# Altium project Timingcard_PROJECT.PrjPcb
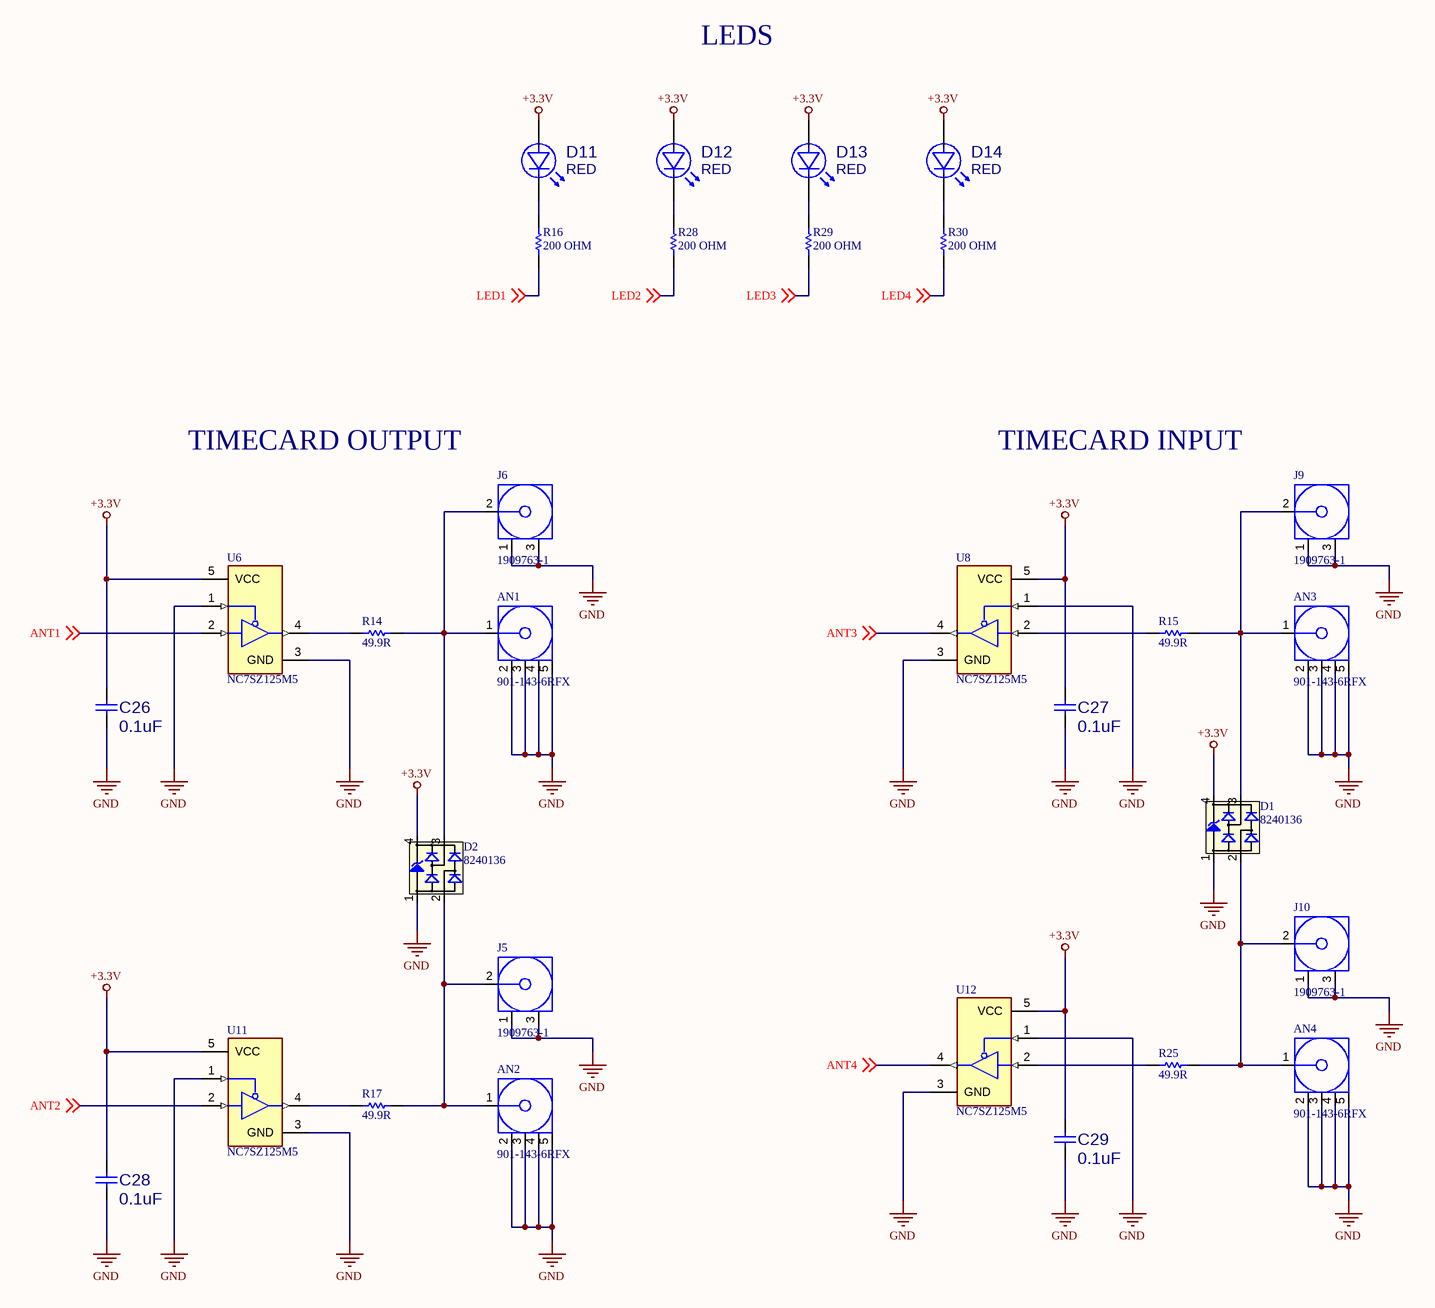
[diagram p0: USER_IO.SchDoc]
4 sheets, 80 parts. Net scope: global (net labels, ports and power ports of the same name join across sheets).
Board file: TimeCard-DC-V2.PcbDoc
Sheets:
  USER_IO.SchDoc
  POWER.SchDoc
  MAC.SchDoc
  FPGA.SchDoc

## Sheet USER_IO.SchDoc
size Tabloid; SheetNumber: 1; SheetTotal: 7

### Parts
AN1  901-143-6RFX  [AMPH-901-143-6RFX_V]
AN2  901-143-6RFX  [AMPH-901-143-6RFX_V]
AN3  901-143-6RFX  [AMPH-901-143-6RFX_V]
AN4  901-143-6RFX  [AMPH-901-143-6RFX_V]
C26  0.1uF  [CAPC1608X87X45ML20T05]
C27  0.1uF  [CAPC1608X87X45ML20T05]
C28  0.1uF  [CAPC1608X87X45ML20T05]
C29  0.1uF  [CAPC1608X87X45ML20T05]
D1  8240136  [SOT143-4L]
D2  8240136  [SOT143-4L]
D11  RED  [DIOM1608X06N]
D12  RED  [DIOM1608X06N]
D13  RED  [DIOM1608X06N]
D14  RED  [DIOM1608X06N]
J5  1909763-1  [TECO-1909763-1_V]
J6  1909763-1  [TECO-1909763-1_V]
J9  1909763-1  [TECO-1909763-1_V]
J10  1909763-1  [TECO-1909763-1_V]
R14  49.9R  [RESC1608X55X25NL10T15]
R15  49.9R  [RESC1608X55X25NL10T15]
R16  200 OHM  [RESC1608X55X30NL15T15]
R17  49.9R  [RESC1608X55X25NL10T15]
R25  49.9R  [RESC1608X55X25NL10T15]
R28  200 OHM  [RESC1608X55X30NL15T15]
R29  200 OHM  [RESC1608X55X30NL15T15]
R30  200 OHM  [RESC1608X55X30NL15T15]
U6  NC7SZ125M5  [FP-318BQ-MFG]
U8  NC7SZ125M5  [FP-318BQ-MFG]
U11  NC7SZ125M5  [FP-318BQ-MFG]
U12  NC7SZ125M5  [FP-318BQ-MFG]

### Nets
+3.3V: C26.1 C27.1 C28.1 C29.1 D1.4(VDD) D2.4(VDD) D11.2(A) D12.2(A) D13.2(A) D14.2(A) U6.5(VCC) U8.5(VCC) U11.5(VCC) U12.5(VCC)
GND: AN1.2 AN1.3 AN1.4 AN1.5 AN2.2 AN2.3 AN2.4 AN2.5 AN3.2 AN3.3 AN3.4 AN3.5 AN4.2 AN4.3 AN4.4 AN4.5 C26.2 C27.2 C28.2 C29.2 D1.1(GND) D2.1(GND) J5.1 J5.3 J6.1 J6.3 J9.1 J9.3 J10.1 J10.3 U6.1(~{OE}) U6.3(GND) U8.1(~{OE}) U8.3(GND) U11.1(~{OE}) U11.3(GND) U12.1(~{OE}) U12.3(GND)
ANT1: U6.2(A) ; off-sheet ANT1
ANT2: U11.2(A) ; off-sheet ANT2
ANT3: U8.4(Y) ; off-sheet ANT3
ANT4: U12.4(Y) ; off-sheet ANT4
LED1: R16.1 ; off-sheet LED1
LED2: R28.1 ; off-sheet LED2
LED3: R29.1 ; off-sheet LED3
LED4: R30.1 ; off-sheet LED4
NetAN1_1: AN1.1 D2.3(I/O2) J6.2 R14.2
NetAN2_1: AN2.1 D2.2(I/O1) J5.2 R17.2
NetAN3_1: AN3.1 D1.3(I/O2) J9.2 R15.2
NetAN4_1: AN4.1 D1.2(I/O1) J10.2 R25.2
NetD11_1: D11.1(K) R16.2
NetD12_1: D12.1(K) R28.2
NetD13_1: D13.1(K) R29.2
NetD14_1: D14.1(K) R30.2
NetR14_1: R14.1 U6.4(Y)
NetR15_1: R15.1 U8.2(A)
NetR17_1: R17.1 U11.4(Y)
NetR25_1: R25.1 U12.2(A)

### Notes on the sheet
- LEDS
- TIMECARD OUTPUT
- TIMECARD INPUT
- SHEET
- timingcard.com <http://timingcard.com>
- OF

### Library data of the parts
AN1-AN4 = CMP-2000-05705-1: Coaxial connector, 50 Ohm, -65 to 165 degC, 5-Pin THD, RoHS, Bulk; Manufacturer: Amphenol; Catalog Drawings: 901-143-6RFXMountingHole; 3D Model: 901-143-6RFX.igs; Body Material: Brass; Connector Type: Jack,FemaleSocket; Shield Termination: Solder; Other Names: 901-143-6-RFX9011436RFXARFX1232; Online Catalog: SMA,RFX; Frequency - Max: 18GHz; Body Finish: Gold; Dielectric Material: Polytetrafluoroethylene(PTFE); Center Contact Material: BerylliumCopper; Impedance: 50Ohm; Connector Style: SMA; Mounting Technology: ThroughHole; Mounting Type: ThroughHole,RightAngle; Cable Group: -; Series: -; Package Description: 5-Pin Through Hole Device, Body 7 x 7 mm, Pitch 2.54 mm; Package Reference: 901-143-6RFX; Voltage Rating: -; Standard Package: 1; Fastening Type: Threaded; Housing Color: Gold; Datasheet URL: http://www.amphenolrf.com/downloads/dl/file/id/2712/product/3102/901_143_6rfx_customer_drawing.pdf; Family: CoaxialConnectors(RF); Contact Termination: Solder; Manufacturer URL: http://www.amphenol.com/; Operating Temperature: -65°C~165°C; Category: Connectors,Interconnects; Packaging: Bulk; Features: -; Center Contact Plating: Gold; Datasheet Version: Rev. C, 06/2010; Ingress Protection: -
C26-C29 = CMP-2006-00003-1: C0603X104K5RACAUTO; Manufacturer: Kemet; Part Number: C0603X104K5RACAUTO
D1 D2 = CMP-1486-00002-1: TVS Diode WE-TVS-HS, VRWM=3.3V; Manufacturer: Wuerth Elektronik; Reverse Stand Off Voltage: 3.3V; PartNumber: 8240136; ComponentLink1Description: Manufacturer URL; PackageReference: SOT143-4L; ComponentLink1URL: http://www.we-online.com; ComponentLink2Description: Datasheet; ComponentLink2URL: http://katalog.we-online.de/kataloge/eisos/media/pdf/8240136.pdf
D11-D14 = SMTLED_RED_0603_SML: LED, RED, SML-LX0603, 635NM, 2V, 20MA, 0603; MFG PART NUM: SML-LX0603IW-TR; VALENTIUM PART NUM: <VALENTIUM>; MFG NAME: LUMEX; MAXTEMP: 85C; MINTEMP: -25C; MODIFY DATE: 9/4/2013; CATEGORY: LED; OTHER: SML-LX0603; P1: 635NM; P2: 2V; P3: 20MA; SIZE: 0603; SHEETPART: *; DESC: LED, RED, SML-LX0603, 635NM, 2V, 20MA, 0603; Supplier 1: Digi-Key; Supplier Part Number 1: 67-1548-1-ND; VALUE: RED
J5 J6 J9 J10 = CMP-2000-07505-1: Ultra Miniature Coaxial Connector Jack, 60 V, 50 Ohm, -40 to 90 degC, RoHS, Tape and Reel; Manufacturer: TE Connectivity; Gender: Female; PCB Mounting Orientation: Vertical; Body Material: LiquidCrystalPolymer; Case\/Package: SMD/SMT; Impedance: 50Ohm; Max Frequency: 6GHz; Body Plating: Gold; Dielectric Material: Polymer; Orientation: Straight; Mount: SurfaceMount; Length: 3mm; Packaging: TapeandReel; Connector Type: Jack; Lead Free: LeadFree; Package Quantity: 1; Termination: SMD/SMT; Contact Material: CopperAlloy; Fastening Type: Pull; RoHSCompliant: true; Max Operating Temperature: 90degC; Datasheet URL: http://www.te.com/commerce/DocumentDelivery/DDEController?Action=srchrtrv&DocNm=1909763&DocType=Customer+Drawing&DocLang=English; Contact Plating: Gold; Mounting Technology: SurfaceMount; Package Reference: TECO-1909763-1; Insulation Material: Thermoplastic; Min Operating Temperature: -40degC; Manufacturer URL: http://www.te.com/; ELV: Compliant; Datasheet Version: Rev. B2, 11/2015; Radiation Hardening: No; Package Description: 3-Pin Surface Mount Device, Body 2.6 x 2.6 mm; Housing Colour: Beige
R14 R15 R17 R25 = CMP-1659-00036-1: General Purpose Chip Resistor, 49.9 Ohm, +/- 1%, -55 to 155 degC, 0603 (1608 Metric), RoHS, Tape and Reel; Max Supply Voltage: 3.63 V; Case\Package: LQFP; Interface: SPI; Min Supply Voltage: 2.97 V; PackageReference: 0603; Packaging: Tray; ComponentLink2Description: Datasheet; ComponentLink1Description: Manufacturer URL; ComponentLink2URL: https://datasheet.ciiva.com/11808/0900766b80f96399-11808223.pdf; RoHSCompliant: true; Max Operating Temperature: 85 degC; ComponentLink1URL: http://www.yageo.com/; PackageDescription: 2-Pin Surface Mount Device, Body 1.6 x 0.8 mm; DatasheetVersion: Rev. 4, 04/2009; Min Operating Temperature: -40 degC; Package Quantity: 250; Pins: 48
R16 R28-R30 = CMP-2000-00316-1: ERJ-3EKF2000V; Manufacturer: Panasonic; Part Number: ERJ-3EKF2000V
U6 U8 U11 U12 = CMP-07111-000001-1: IC BUF NON-INVERT 5.5V SOT23-5; Manufacturer: ON Semiconductor; Number Of Circuits: 1; Max Junction Temp: +150°C; Standoff Height: 0.01mm; Logic Function Desc: Non-Inverting; Nominal Supply Current: 2uA; Min Supply Voltage: 1.65V; Propagation Delay: 2.6ns; Temperature Range High: +85°C; Number Of Outputs: 1; RoHS: TRUE; Automotive: No; Category: IC; Ambient Temperature Range High: +85°C; Manufacturer Part Number: NC7SZ125M5; Device Class L3: Buffers; Temperature Range Low: -40°C; Mouser Description: Buffers & Line Drivers Buffer w/ 3-STAT O; Ambient Temperature Range Low: -40°C; Lead Free: Yes; Ipc Land Pattern Name: SOT95P275X100-5; Footprint Url: https://www.onsemi.com/pub/Collateral/527AH.PDF; Device Class L2: Logic ICs; Max Supply Voltage: 5.5V; Quiescent Current: 2uA; Number Of Inputs: 1; Height: 1.1mm; Temperature: -40°C to +85°C; Device Class L1: Integrated Circuits (ICs); ComponentLink2URL: https://www.onsemi.com/pub/Collateral/NC7SZ125-D.PDF; Digikey Description: IC BUF NON-INVERT 5.5V SOT23-5; Package: 318BQ; Octopart: https://octopart.com/nc7sz125m5-on+semiconductor-84330746; ComponentLink2Description: Datasheet

## Sheet POWER.SchDoc: Grandmaster Power Supplies
size Tabloid; Author: N Smith; Revision: A; SheetNumber: 2; SheetTotal: 7; Customer: 01910
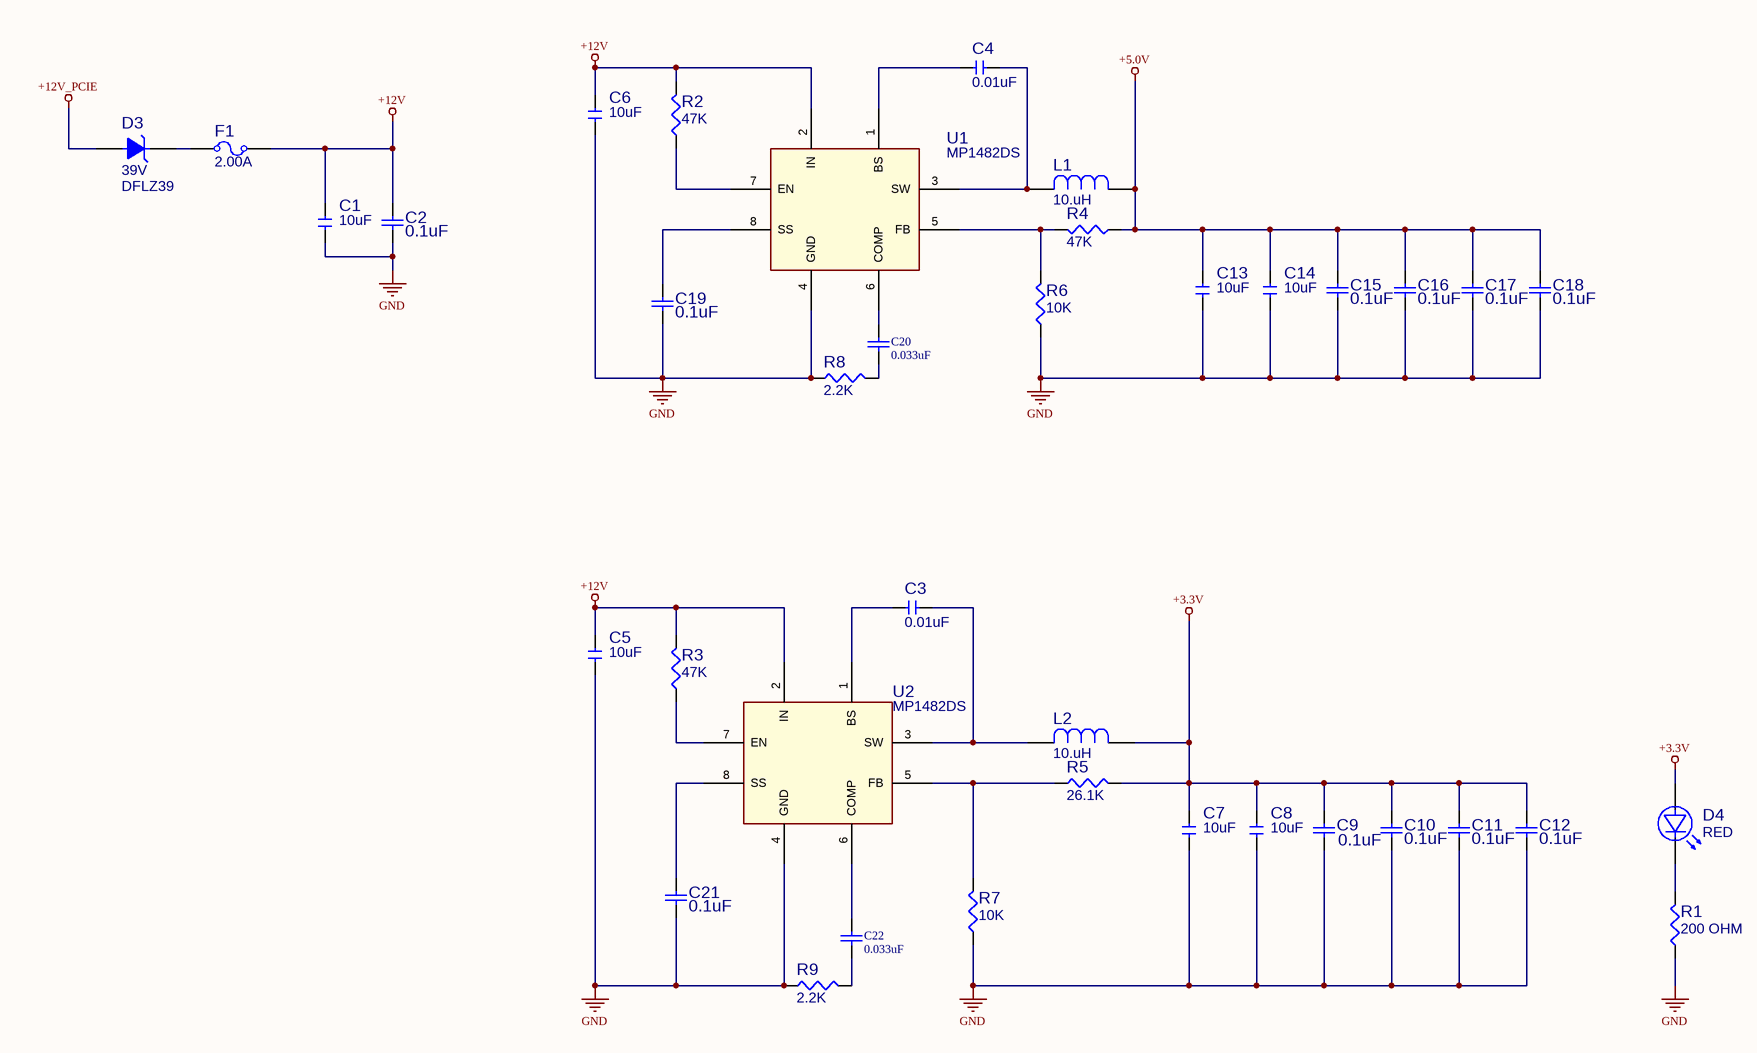
[diagram p1: POWER.SchDoc]

### Parts
C1  value 10uF  [CAPC2012X14N]  (hidden comment: CAP_0805_10UF_25V)
C2  0.1uF  [CAPC1608X87X45ML20T05]
C3  value 0.01uF  [CAPC1608X10N]  (hidden comment: CAP_0603_0.01UF_50V)
C4  value 0.01uF  [CAPC1608X10N]  (hidden comment: CAP_0603_0.01UF_50V)
C5  value 10uF  [CAPC2012X14N]  (hidden comment: CAP_0805_10UF_25V)
C6  value 10uF  [CAPC2012X14N]  (hidden comment: CAP_0805_10UF_25V)
C7  value 10uF  [CAPC2012X14N]  (hidden comment: CAP_0805_10UF_25V)
C8  value 10uF  [CAPC2012X14N]  (hidden comment: CAP_0805_10UF_25V)
C9  0.1uF  [CAPC1608X87X45ML20T05]
C10  0.1uF  [CAPC1608X87X45ML20T05]
C11  0.1uF  [CAPC1608X87X45ML20T05]
C12  0.1uF  [CAPC1608X87X45ML20T05]
C13  value 10uF  [CAPC2012X14N]  (hidden comment: CAP_0805_10UF_25V)
C14  value 10uF  [CAPC2012X14N]  (hidden comment: CAP_0805_10UF_25V)
C15  0.1uF  [CAPC1608X87X45ML20T05]
C16  0.1uF  [CAPC1608X87X45ML20T05]
C17  0.1uF  [CAPC1608X87X45ML20T05]
C18  0.1uF  [CAPC1608X87X45ML20T05]
C19  0.1uF  [CAPC1608X87X45ML20T05]
C20  0.033uF  [CAPC1608X90X35NL10T15]
C21  0.1uF  [CAPC1608X87X45ML20T05]
C22  0.033uF  [CAPC1608X90X35NL10T15]
D3  value DFLZ39  P1: 39V  [SODFL370X135-2N]  (hidden comment: DFLZ39-TP)
D4  RED  [DIOM1608X06N]
F1  value 2.00A  [FUSM1608X60N]  (hidden comment: FUSE_0603_2.00A)
L1  value 10.uH  [IND_PM124SH]  (hidden comment: PM124SH-100M-RC)
L2  value 10.uH  [IND_PM124SH]  (hidden comment: PM124SH-100M-RC)
R1  value 200 OHM  [RESC1608X50N]  (hidden comment: ERJ-3EKF2000V)
R2  value 47K  [RESC1608X50N]  (hidden comment: ERJ-3EKF4702V)
R3  value 47K  [RESC1608X50N]  (hidden comment: ERJ-3EKF4702V)
R4  value 47K  [RESC1608X50N]  (hidden comment: ERJ-3EKF4702V)
R5  value 26.1K  [RESC1608X50N]  (hidden comment: ERJ-3EKF2612V)
R6  value 10K  [RESC1608X50N]  (hidden comment: ERJ-3EKF1002V)
R7  value 10K  [RESC1608X50N]  (hidden comment: ERJ-3EKF1002V)
R8  value 2.2K  [RESC1608X50N]  (hidden comment: ERJ-3EKF2201V)
R9  value 2.2K  [RESC1608X50N]  (hidden comment: ERJ-3EKF2201V)
U1  value MP1482DS  [SOIC127P600X175-8N]  (hidden comment: MP1482DS-LF)
U2  value MP1482DS  [SOIC127P600X175-8N]  (hidden comment: MP1482DS-LF)

### Nets
+3.3V: C7.1 C8.1 C9.2 C10.2 C11.2 C12.2 D4.2(A) L2.1 R5.2
+5.0V: C13.1 C14.1 C15.2 C16.2 C17.2 C18.2 L1.1 R4.1
+12V: C1.1 C2.2 C5.1 C6.1 F1.2 R2.2 R3.2 U1.2(IN) U2.2(IN)
+12V_PCIE: D3.2(A)
GND: C1.2 C2.1 C5.2 C6.2 C7.2 C8.2 C9.1 C10.1 C11.1 C12.1 C13.2 C14.2 C15.1 C16.1 C17.1 C18.1 C19.1 C21.1 R1.1 R6.1 R7.1 R8.1 R9.1 U1.4(GND) U2.4(GND)
NetC3_1: C3.1 U2.1(BS)
NetC3_2: C3.2 L2.2 U2.3(SW)
NetC4_1: C4.1 U1.1(BS)
NetC4_2: C4.2 L1.2 U1.3(SW)
NetC19_2: C19.2 U1.8(SS)
NetC20_1: C20.1 R8.2
NetC20_2: C20.2 U1.6(COMP)
NetC21_2: C21.2 U2.8(SS)
NetC22_1: C22.1 R9.2
NetC22_2: C22.2 U2.6(COMP)
NetD3_1: D3.1(C) F1.1
NetD4_1: D4.1(K) R1.2
NetR2_1: R2.1 U1.7(EN)
NetR3_1: R3.1 U2.7(EN)
NetR4_2: R4.2 R6.2 U1.5(FB)
NetR5_1: R5.1 R7.2 U2.5(FB)

### Notes on the sheet
- SHEET
- timingcard.com <http://timingcard.com>
- OF

### Library data of the parts
C1 C5-C8 C13 C14 = CAP_0805_10UF_25V: CAP, CER, 10.UF, 25V, 10%, X5R, 0805; MFG PART NUM: TMK212BBJ106KG-T; VALENTIUM PART NUM: <VALENTIUM>; MFG NAME: TAIYO YUDEN; MAXTEMP: 85C; MINTEMP: -55C; DESC: CAP, CER, 10.UF, 10V, 10%, X5R, 0805; MODIFY DATE: 10/23/2013; CATEGORY: CAP, CER; Date: 4/11/2006 3:37:28 PM; SHEETPART: *; P1: 10%; P2: 25V; P3: X5R; Size: 0805; Supplier 1: MOUSER; Supplier Part Number 1: 963-TMK212BBJ106KG-T
C2 C9-C12 C15-C19 C21 = CMP-2006-00003-1: C0603X104K5RACAUTO; Manufacturer: Kemet; Part Number: C0603X104K5RACAUTO
C3 C4 = CAP_0603_0.01UF_50V: CAP, CER, 0.01UF, 50V, 10%, X7R, 0603; MFG PART NUM: C0603C103K5RACTU; VALENTIUM PART NUM: <VALENTIUM>; MFG NAME: KEMET; MAXTEMP: 125C; MINTEMP: -55C; CATEGORY: CAP, CER; MODIFY DATE: 10/23/2013; Date: 7/24/2013; SHEETPART: *; P1: 10%; P2: 50V; P3: X7R; Size: 0603; Supplier 1: Digi-Key; Supplier Part Number 1: 399-1091-1-ND; DESC: CAP, CER, 0.01UF, 50V, 10%, X7R, 0603
C20 C22 = CMP-2006-02385-1: GCM188R71H333KA55D; Manufacturer: Murata; Part Number: GCM188R71H333KA55D
D3 = DFLZ39: DIO, ZENER, DFLZ39, 39V, 5%, 1W, SOD123FL; VALENTIUM PART NUM: <VALENTIUM>; MFG NAME: MICRO COMM; MAXTEMP: 150C; MINTEMP: -55C; OTHER: SERIES; MFG PART NUM: DFLZ39-TP; MODIFY DATE: 9/4/2013; CATEGORY: DIO, ZENER; P2: 5%; P3: 1W; SIZE: SOD123FL; SHEETPART: *; DESC: DIO, ZENER, DFLZ39, 39V, 5%, 1W, SOD123FL; Supplier 1: Digi-Key; Supplier Part Number 1: DFLZ39-TPMSDKR-ND
D4 = SMTLED_RED_0603_SML: as D11 on sheet USER_IO; MODIFY DATE: 9/4/2013; CATEGORY: LED; OTHER: SML-LX0603; P1: 635NM; P2: 2V; P3: 20MA; SIZE: 0603; SHEETPART: *; DESC: LED, RED, SML-LX0603, 635NM, 2V, 20MA, 0603; Supplier 1: Digi-Key; Supplier Part Number 1: 67-1548-1-ND; VALUE: RED
F1 = FUSE_0603_2.00A: FUSE SLOW 2.00A 32V M 0603; MFG PART NUM: SF-0603S200-2; VALENTIUM PART NUM: <VALENTIUM>; MFG NAME: BOURNS; MAXTEMP: 105C; MINTEMP: -40C; OTHER: UL E141069; P1: SLOW BLO; DESC: FUSE SLOW 1.25A 32V M 0603; MODIFY DATE: 9/4/2013; CATEGORY: FUSE; DATE: 20 OCT 15; P2: 32V; P3: M; SIZE: 0603; SHEETPART: *; Supplier 1: Digi-Key; Supplier Part Number 1: SF-0603S200-2CT-ND
L1 L2 = PM124SH-100M-RC: IND, PWR, 10.uH, 20%, 4A, 0.04DCR, 12.5X12.5MM, SHLD; VALENTIUM PART NUM: <VALENTIUM>; MFG NAME: BOURNS; MAXTEMP: 125C; MINTEMP: -40C; P3: 36mOhm; MFG PART NUM: PM124SH-100M-RC; MODIFY DATE: 10/23/2013; Date: 10/23/2013; CATEGORY: IND, PWR; OTHER: SHLD; P1: 20%; P2: 4A; SIZE: 12.5X12.5MM; SHEETPART: *; DESC: IND, PWR, 10.uH, 20%, 4A, 0.04DCR, 12.5X12.5MM, SHLD; Supplier 1: Digi-Key; Supplier Part Number 1: PM124SH-100M-RCCT-ND
R1 = RES_0603_200: RES, 200 OHM, 1%, 1/10W, TF, 0603; VELENTIUM PART NUM: <VELENTIUM>; MFG NAME: PANASONIC; MAXTEMP: 125C; MINTEMP: -55C; OTHER: 100PPM; SUB: GENERIC; ModifyDate: 7/25/2013; MFG PART NUM: ERJ-3EKF2000V; CATEGORY: RES; Date: 7/26/2013; P1: 1%; P3: TF; P2: 1/10W; SIZE: 0603; SHEETPART: *; DESC: RES, 200 OHM, 1%, 1/10W, TF, 0603; Supplier 1: Digi-Key; Supplier Part Number 1: P200HCT-ND
R2-R4 = RES_0603_47K: RES, 47K, 1%, 1/10W, TF, 0603; VELENTIUM PART NUM: <VELENTIUM>; MFG NAME: PANASONIC; MAXTEMP: 125C; MINTEMP: -55C; OTHER: 100PPM; SUB: GENERIC; ModifyDate: 1/22/2014; MFG PART NUM: ERJ-3EKF4702V; CATEGORY: RES; Date: 1/22/2014; P1: 1%; P3: TF; P2: 1/10W; SIZE: 0603; SHEETPART: *; DESC: RES, 47K, 1%, 1/10W, TF, 0603; Supplier 1: Digi-Key; Supplier Part Number 1: P47.0KHCT-ND
R5 = RES_0603_26.1K: RES, 26.1K, 1%, 1/10W, TF, 0603; VELENTIUM PART NUM: <VELENTIUM>; MFG NAME: PANASONIC; MAXTEMP: 125C; MINTEMP: -55C; OTHER: 100PPM; SUB: GENERIC; DESC: RES, 27.1K, 1%, 1/10W, TF, 0603; ModifyDate: 7/25/2013; MFG PART NUM: ERJ-3EKF2612V; CATEGORY: RES; Date: 7/26/2013; P1: 1%; P3: TF; P2: 1/10W; SIZE: 0603; SHEETPART: *; Supplier 1: Digi-Key; Supplier Part Number 1: P26.1KHCT-ND
R6 R7 = RES_0603_10K: RES, 10K, 1%, 1/10W, TF, 0603; VELENTIUM PART NUM: <VELENTIUM>; MFG NAME: PANASONIC; MAXTEMP: 125C; MINTEMP: -55C; OTHER: 100PPM; SUB: GENERIC; ModifyDate: 7/25/2013; MFG PART NUM: ERJ-3EKF1002V; CATEGORY: RES; Date: 7/26/2013; P1: 1%; P3: TF; P2: 1/10W; SIZE: 0603; Supplier 1: Digi-Key; Supplier Part Number 1: P10.0KHCT-ND; SHEETPART: *; DESC: RES, 10K, 1%, 1/10W, TF, 0603
R8 R9 = RES_0603_2.2K: RES, 2.2K, 1%, 1/10W, TF, 0603; VELENTIUM PART NUM: <VELENTIUM>; MFG NAME: PANASONIC; MAXTEMP: 125C; MINTEMP: -55C; OTHER: 100PPM; SUB: GENERIC; ModifyDate: 8/15/2013; MFG PART NUM: ERJ-3EKF2201V; CATEGORY: RES; Date: 8/15/2013; P1: 1%; P3: TF; P2: 1/10W; SIZE: 0603; Supplier 1: Digi-Key; Supplier Part Number 1: P2.20KHCT-ND; SHEETPART: *; DESC: RES, 2.2K, 1%, 1/10W, TF, 0603
U1 U2 = MP1482DS: IC, DC/DC, MP1482DS, >4.75VIN, 0.923-15V OUT, SOIC8; VELENTIUM PART NUM: <V PART NUM>; MFG NAME: MPS; MAXTEMP: +85C; MINTEMP: -40C; OTHER: additional spec; P3: W; MFG PART NUM: MP1482DS-LF; MODIFY DATE: 12/27/2005 8:34:25 AM; CATEGORY: IC, DC/DC; P1: >4.75V IN; P2: 0.923-15V OUT; SIZE: 8SOIC; SHEETPART: *; DESC: IC, DC/DC, MP1482DS, >4.75VIN, 0.923-15V OUT, SOIC8; Supplier 1: Digi-Key; Supplier Part Number 1: 1589-1524-1-ND

## Sheet MAC.SchDoc: Grandmaster MAC & Clock Generation
size Tabloid; Author: N Smith; Revision: A; SheetNumber: 6; SheetTotal: 7; Customer: 01910
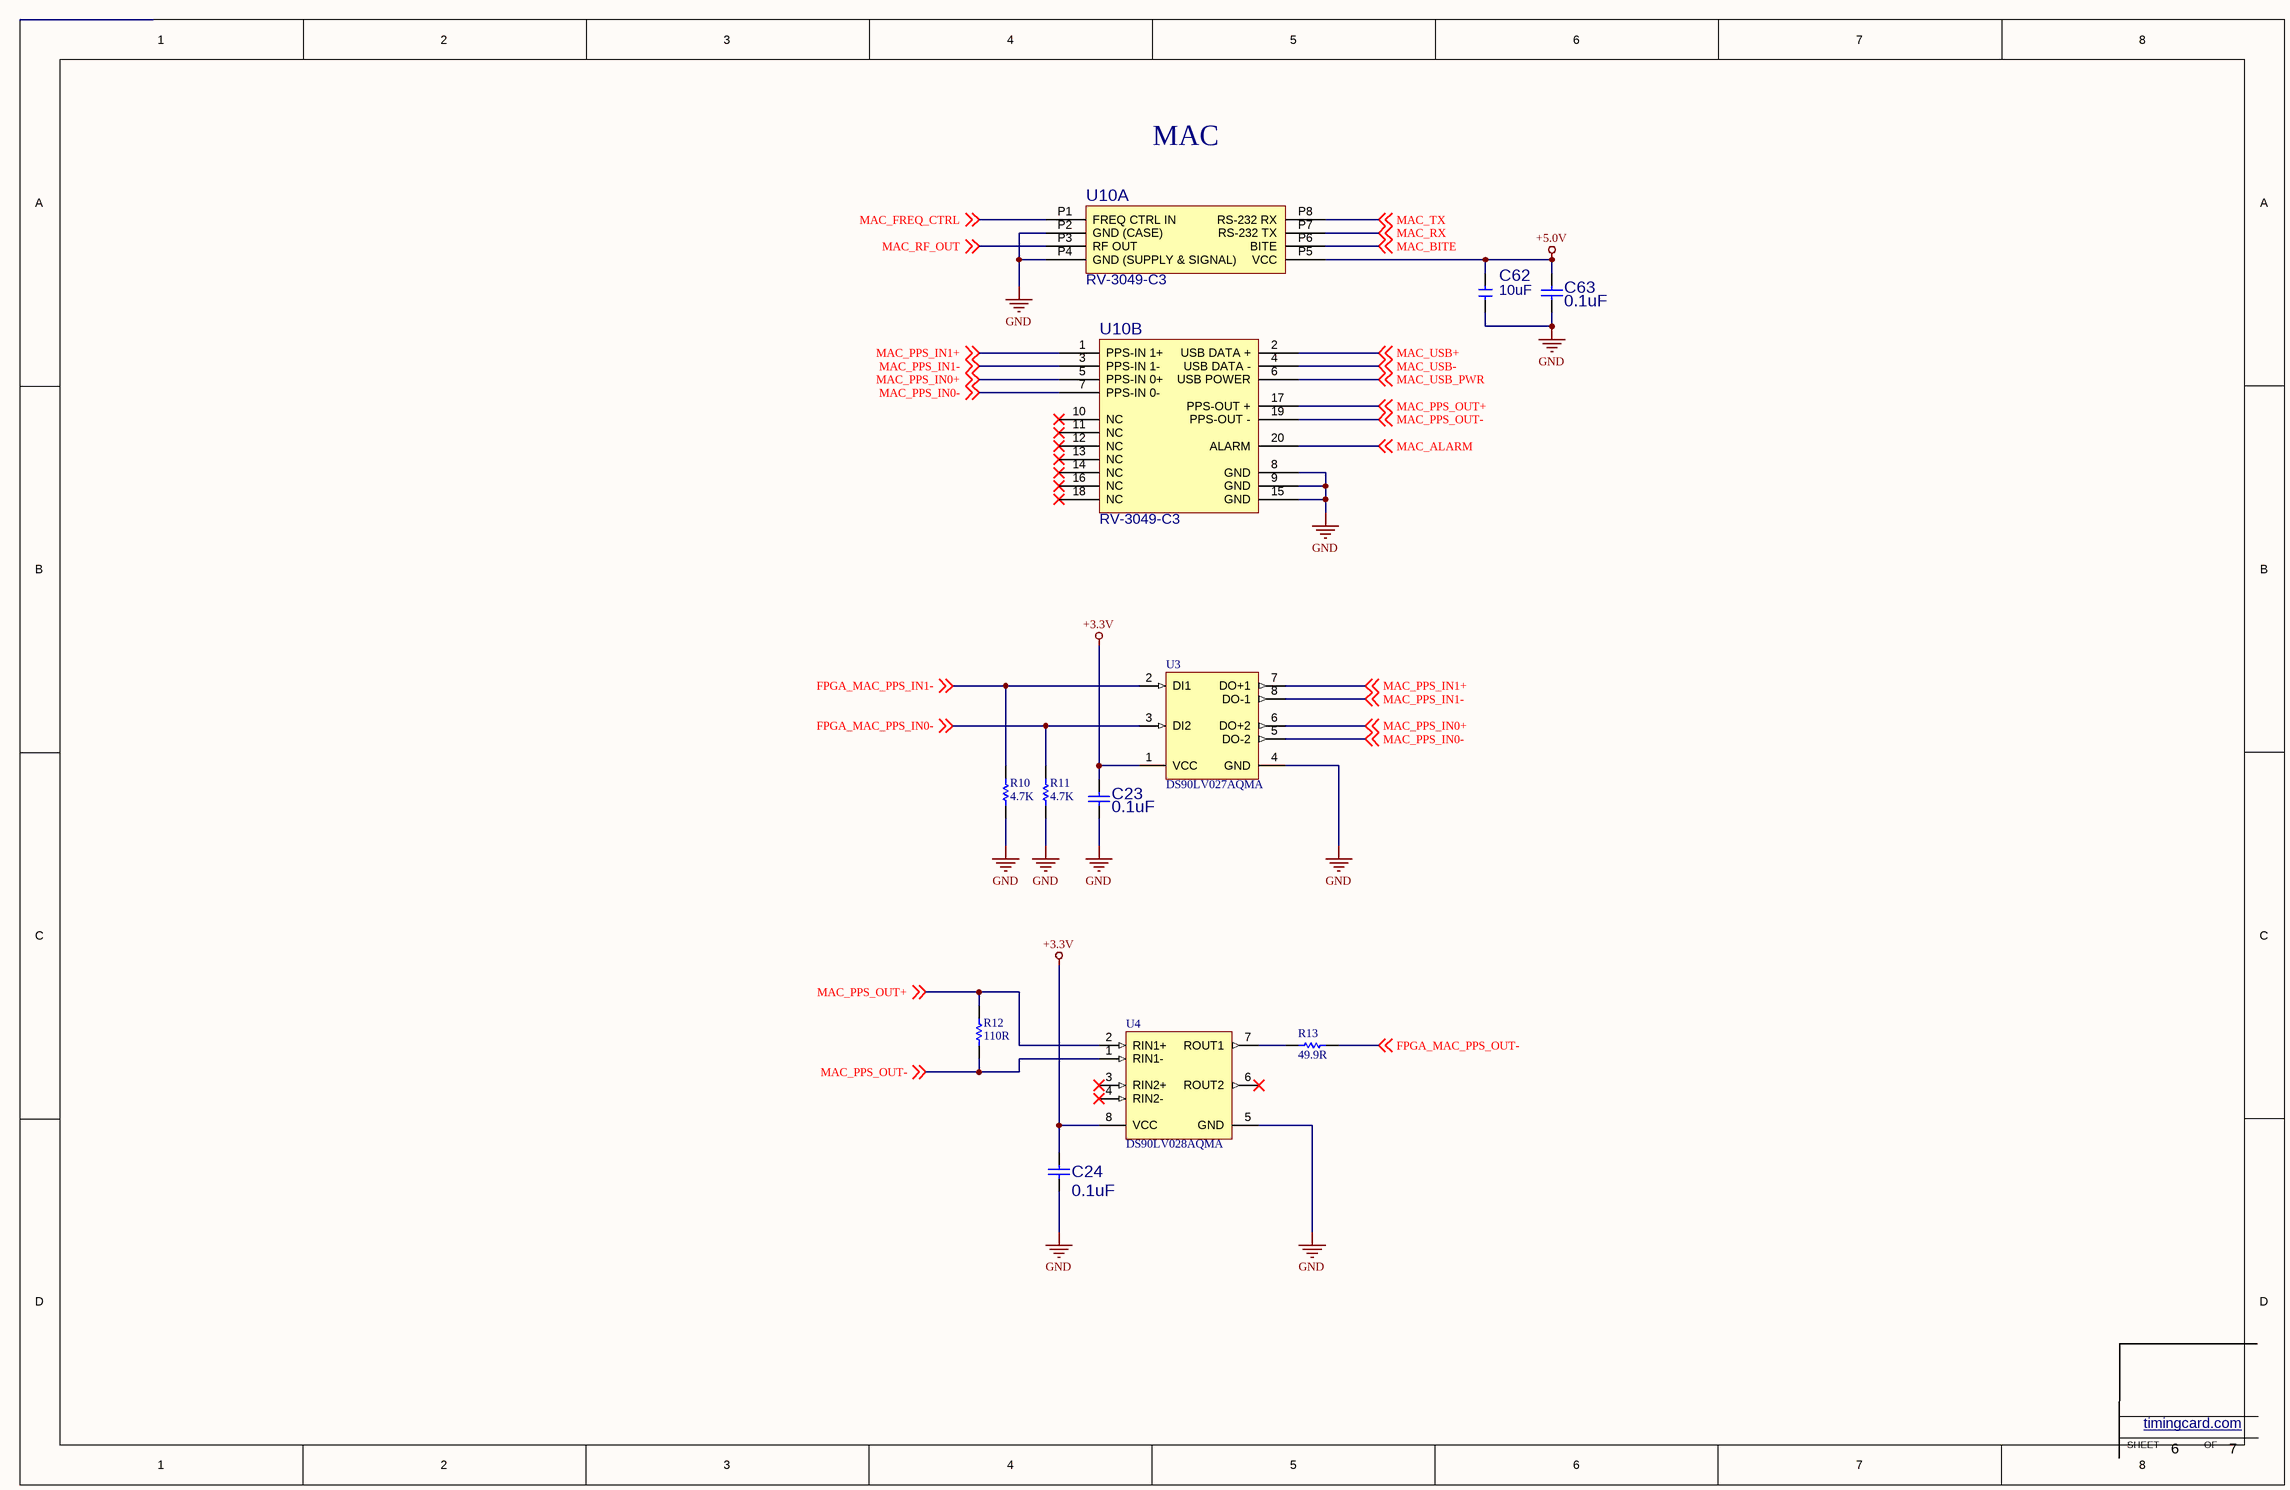
[diagram p2: MAC.SchDoc]

### Parts
C23  0.1uF  [CAPC1608X87X45ML20T05]
C24  0.1uF  [CAPC1608X87X45ML20T05]
C62  value 10uF  [CAPC2012X14N]  (hidden comment: CAP_0805_10UF_25V)
C63  0.1uF  [CAPC1608X87X45ML20T05]
R10  4.7K  [RESC1608X55X25LL10T15]
R11  4.7K  [RESC1608X55X25LL10T15]
R12  110R  [RESC1609X50X30NL10T20]
R13  49.9R  [RESC1608X55X25NL10T15]
U3  DS90LV027AQMA  [M08A_N]
U4  DS90LV028AQMA  [M08A_L]
U10  value RV-3049-C3  [SA53]  (hidden comment: MAC-SA5X)  (parts A,B of 2)

### Nets
+3.3V: C23.2 C24.1 U3.1(VCC) U4.8(VCC)
+5.0V: C62.1 C63.2 U10.P5(VCC)
GND: C23.1 C24.2 C62.2 C63.1 R10.1 R11.1 U3.4(GND) U4.5(GND) U10.8(GND) U10.9(GND) U10.15(GND) U10.P2(GND_(CASE)) U10.P4(GND_(SUPPLY_&_SIGNAL))
FPGA_MAC_PPS_IN0-: R11.2 U3.3(DI2) ; off-sheet FPGA_MAC_PPS_IN0-
FPGA_MAC_PPS_IN1-: R10.2 U3.2(DI1) ; off-sheet FPGA_MAC_PPS_IN1-
FPGA_MAC_PPS_OUT-: R13.2 ; off-sheet FPGA_MAC_PPS_OUT-
MAC_ALARM: U10.20(ALARM) ; off-sheet MAC_ALARM
MAC_BITE: U10.P6(BITE) ; off-sheet MAC_BITE
MAC_FREQ_CTRL: U10.P1(FREQ_CTRL_IN) ; off-sheet MAC_FREQ_CTRL
MAC_PPS_IN0+: U3.6(DO+2) U10.5(PPS-IN_0+) ; off-sheet MAC_PPS_IN0+
MAC_PPS_IN0-: U3.5(DO-2) U10.7(PPS-IN_0-) ; off-sheet MAC_PPS_IN0-
MAC_PPS_IN1+: U3.7(DO+1) U10.1(PPS-IN_1+) ; off-sheet MAC_PPS_IN1+
MAC_PPS_IN1-: U3.8(DO-1) U10.3(PPS-IN_1-) ; off-sheet MAC_PPS_IN1-
MAC_PPS_OUT+: R12.2 U4.2(RIN1+) U10.17(PPS-OUT_+) ; off-sheet MAC_PPS_OUT+
MAC_PPS_OUT-: R12.1 U4.1(RIN1-) U10.19(PPS-OUT_-) ; off-sheet MAC_PPS_OUT-
MAC_RF_OUT: U10.P3(RF_OUT) ; off-sheet MAC_RF_OUT
MAC_RX: U10.P7(RS-232_TX) ; off-sheet MAC_RX
MAC_TX: U10.P8(RS-232_RX) ; off-sheet MAC_TX
MAC_USB+: U10.2(USB_DATA_+) ; off-sheet MAC_USB+
MAC_USB-: U10.4(USB_DATA_-) ; off-sheet MAC_USB-
MAC_USB_PWR: U10.6(USB_POWER) ; off-sheet MAC_USB_PWR
NetR13_1: R13.1 U4.7(ROUT1)

Not connected (* = marked no-connect by the designer): U4 3(RIN2+)* 4(RIN2-)* 6(ROUT2)*; U10 10(NC)* 11(NC)* 12(NC)* 13(NC)* 14(NC)* 16(NC)* 18(NC)*

### Notes on the sheet
- MAC
- SHEET
- timingcard.com <http://timingcard.com>
- OF

### Library data of the parts
C23 C24 C63 = CMP-2006-00003-1: C0603X104K5RACAUTO; Manufacturer: Kemet; Part Number: C0603X104K5RACAUTO
C62 = CAP_0805_10UF_25V: as C1 on sheet POWER; MODIFY DATE: 10/23/2013; CATEGORY: CAP, CER; Date: 4/11/2006 3:37:28 PM; SHEETPART: *; P1: 10%; P2: 25V; P3: X5R; Size: 0805; Supplier 1: MOUSER; Supplier Part Number 1: 963-TMK212BBJ106KG-T
R10 R11 = CMP-2000-06942-1: Chip Resistor, 4.7 KOhm, +/- 1%, 0.1 W, -55 to 155 degC, 0603 (1608 Metric), RoHS, Tape and Reel RC0603FR-074K7L; Manufacturer: Yageo; Power Rating: 100mW; Temperature Coefficient: 100PPM/C; Resistance: 4.7kOhms; Voltage Rating: 50V; Package Reference: 0603; Series: RC; Datasheet Version: Rev. 7, 05/2017; Packaging: Reel; Termination Style: SMD/SMT; Datasheet URL: http://www.yageo.com/documents/recent/PYu-RC_Group_51_RoHS_L_7.pdf; Manufacturer URL: http://www.yageo.com/; Package Description: 2-Pin Surface Mount Device, Body 1.6 x 0.8 mm; Case Code - mm: 1608; Case Code - in: 0603; Mounting Technology: SurfaceMount; Operating Temperature Range: -55Cto+155C; Tolerance: 1%; Product: ThickFilmResistorsGeneralPurpose
R12 = CMP-2000-03854-1: Part Number: CRCW0603110RFKEA; Manufacturer: Vishay Dale
R13 = CMP-1659-00036-1: as R14 on sheet USER_IO; PackageReference: 0603; Packaging: Tray; ComponentLink2Description: Datasheet; ComponentLink1Description: Manufacturer URL; ComponentLink2URL: https://datasheet.ciiva.com/11808/0900766b80f96399-11808223.pdf; RoHSCompliant: true; Max Operating Temperature: 85 degC; ComponentLink1URL: http://www.yageo.com/; PackageDescription: 2-Pin Surface Mount Device, Body 1.6 x 0.8 mm; DatasheetVersion: Rev. 4, 04/2009; Min Operating Temperature: -40 degC; Package Quantity: 250; Pins: 48
U3 = CMP-0058-01000-2: Automotive LVDS Dual Differential Driver, 8-pin Narrow SOIC; Manufacturer: National Semiconductor; PackageTopMarking: NSZXTT*90LV0*27AQM; CompType: Interface IC; PowerWise: N; DatasheetVersion: Oct-2008; PinCount: 8; RevisionNote: Component URLs added; Code_IPC: SOIC127P600-8; ComponentLink1URL: http://www.national.com/ds/DS/DS90LV027AQ.pdf; ComponentLink3Description: M08A Package Page; PackageDescription: SOIC Narrow, 4.9 x 3.9 x 1.45mm, 8 Lead, 1.27mm Pitch; ComponentLink2Description: DS90LV027AQ Web Page; ComponentLink2URL: http://www.national.com/pf/DS/DS90LV027AQ.html; RoHS: Y; Code_JEDEC: MS-012-AA; PackageReference: M08A; PackageVersion: revM, May-2009; ComponentLink1Description: DS90LV027AQ Datasheet; ComponentLink3URL: http://www.national.com/packaging/folders/m08a.html
U4 = CMP-0058-01010-2: Automotive LVDS Dual Differential Line Receiver, 8-pin Narrow SOIC; Manufacturer: National Semiconductor; PowerWise: N; PackageTopMarking: NSZXTT*90LV0*28AQM; CompType: Interface IC; DatasheetVersion: Oct-2008; PackageReference: M08A; RevisionNote: Component URLs added; Code_JEDEC: MS-012-AA; PackageVersion: revM, May-2009; ComponentLink1URL: http://www.national.com/ds/DS/DS90LV028AQ.pdf; PinCount: 8; ComponentLink3Description: M08A Package Page; ComponentLink1Description: DS90LV028AQ Datasheet; Code_IPC: SOIC127P600-8; RoHS: Y; ComponentLink2URL: http://www.national.com/pf/DS/DS90LV028AQ.html; PackageDescription: SOIC Narrow, 4.9 x 3.9 x 1.45mm, 8 Lead, 1.27mm Pitch; ComponentLink2Description: DS90LV028AQ Web Page; ComponentLink3URL: http://www.national.com/packaging/folders/m08a.html
U10 = MAC-SA5X: MOD, MAC, MAC-SA5X, ATOMIC CLOCK; VELENTIUM PART NUM: <V PART NUM>; MFG NAME: MICROCHIP; MAXTEMP: 85C; MINTEMP: -40C; OTHER: AEC-Q200; MODIFY DATE: 3/22/2006 1:36:44 PM; MFG PART NUM: MAC-SA5X; CATEGORY: MOD; P1: ATOMIC CLOCK; SHEETPART: *; DESC: MOD, MAC, MAC-SA5X, ATOMIC CLOCK

## Sheet FPGA.SchDoc: Grandmaster FPGA Connectors
size Tabloid; Author: N Smith; Revision: A; SheetNumber: 7; SheetTotal: 7; Customer: 01910
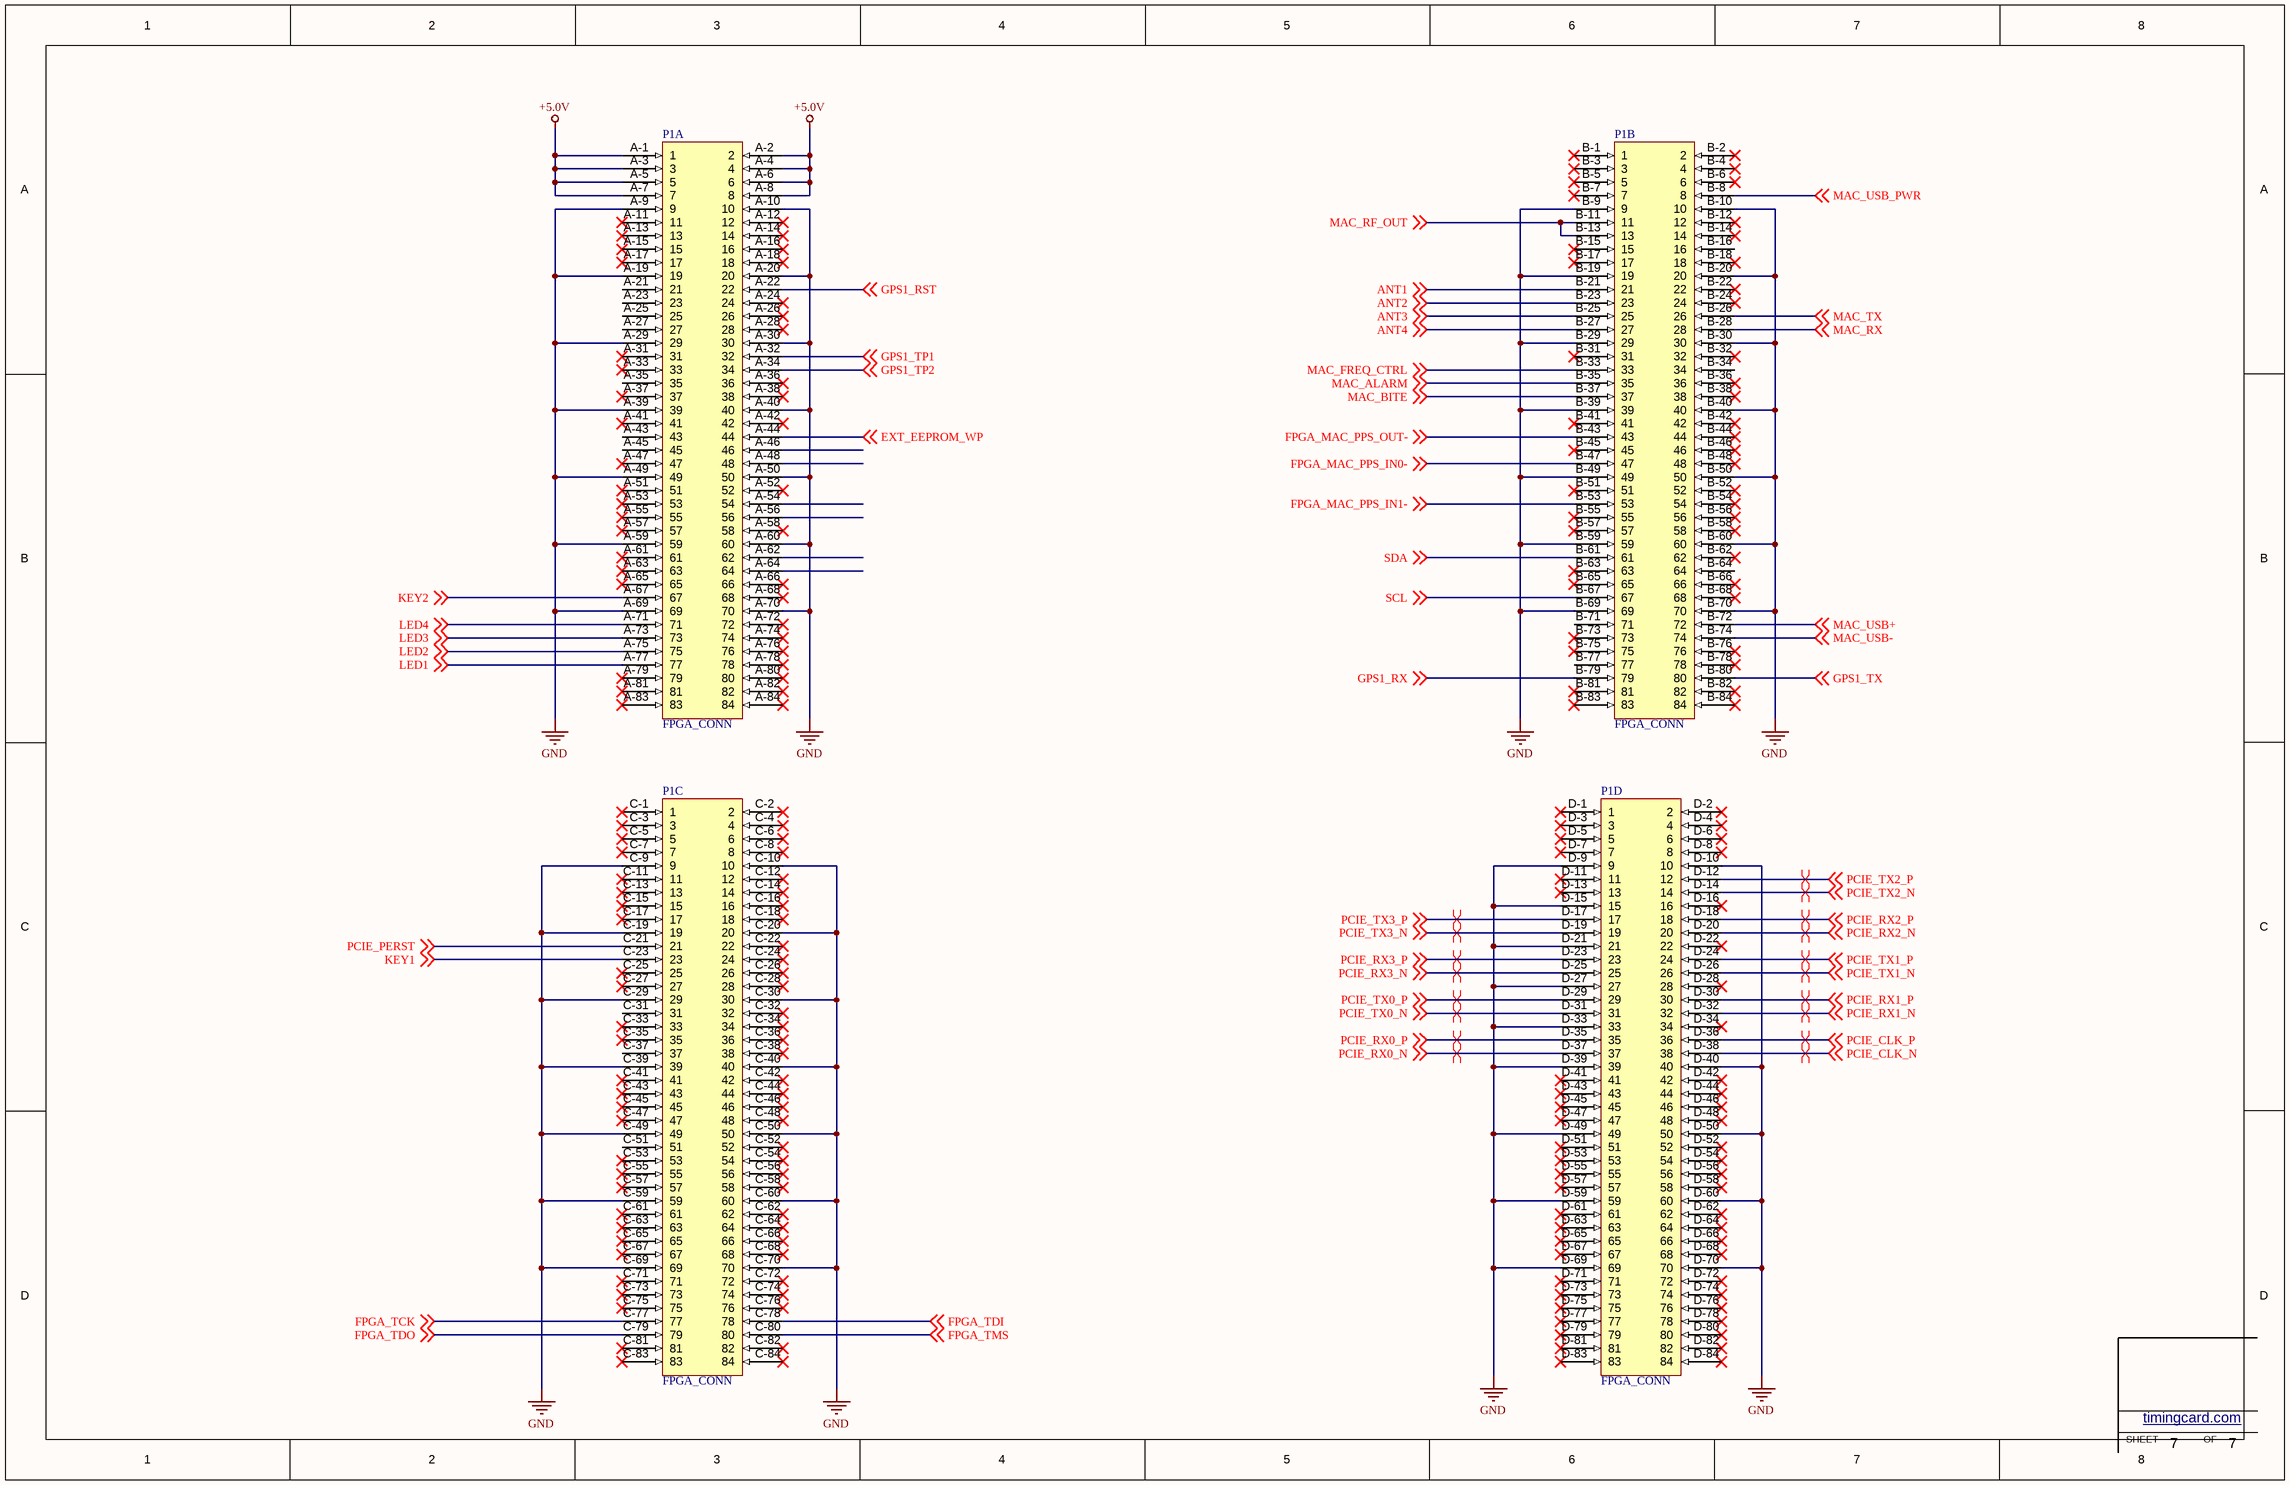
[diagram p3: FPGA.SchDoc]

### Parts
P1  FPGA_CONN  [FPGA_CONN]  (parts A,B,C,D of 4)

### Nets
+5.0V: P1.A-1(1) P1.A-2(2) P1.A-3(3) P1.A-4(4) P1.A-5(5) P1.A-6(6) P1.A-7(7) P1.A-8(8)
GND: P1.A-9(9) P1.A-10(10) P1.A-19(19) P1.A-20(20) P1.A-29(29) P1.A-30(30) P1.A-39(39) P1.A-40(40) P1.A-49(49) P1.A-50(50) P1.A-59(59) P1.A-60(60) P1.A-69(69) P1.A-70(70) P1.B-9(9) P1.B-10(10) P1.B-19(19) P1.B-20(20) P1.B-29(29) P1.B-30(30) P1.B-39(39) P1.B-40(40) P1.B-49(49) P1.B-50(50) P1.B-59(59) P1.B-60(60) P1.B-69(69) P1.B-70(70) P1.C-9(9) P1.C-10(10) P1.C-19(19) P1.C-20(20) P1.C-29(29) P1.C-30(30) P1.C-39(39) P1.C-40(40) P1.C-49(49) P1.C-50(50) P1.C-59(59) P1.C-60(60) P1.C-69(69) P1.C-70(70) P1.D-9(9) P1.D-10(10) P1.D-15(15) P1.D-21(21) P1.D-27(27) P1.D-33(33) P1.D-39(39) P1.D-40(40) P1.D-49(49) P1.D-50(50) P1.D-59(59) P1.D-60(60) P1.D-69(69) P1.D-70(70)
ANT1: P1.B-21(21) ; off-sheet ANT1
ANT2: P1.B-23(23) ; off-sheet ANT2
ANT3: P1.B-25(25) ; off-sheet ANT3
ANT4: P1.B-27(27) ; off-sheet ANT4
EXT_EEPROM_WP: P1.A-44(44) ; off-sheet EXT_EEPROM_WP
FPGA_MAC_PPS_IN0-: P1.B-47(47) ; off-sheet FPGA_MAC_PPS_IN0-
FPGA_MAC_PPS_IN1-: P1.B-53(53) ; off-sheet FPGA_MAC_PPS_IN1-
FPGA_MAC_PPS_OUT-: P1.B-43(43) ; off-sheet FPGA_MAC_PPS_OUT-
FPGA_TCK: P1.C-77(77) ; off-sheet FPGA_TCK
FPGA_TDI: P1.C-78(78) ; off-sheet FPGA_TDI
FPGA_TDO: P1.C-79(79) ; off-sheet FPGA_TDO
FPGA_TMS: P1.C-80(80) ; off-sheet FPGA_TMS
GPS1_RST: P1.A-22(22) ; off-sheet GPS1_RST
GPS1_RX: P1.B-79(79) ; off-sheet GPS1_RX
GPS1_TP1: P1.A-32(32) ; off-sheet GPS1_TP1
GPS1_TP2: P1.A-34(34) ; off-sheet GPS1_TP2
GPS1_TX: P1.B-80(80) ; off-sheet GPS1_TX
KEY1: P1.C-23(23) ; off-sheet KEY1
KEY2: P1.A-67(67) ; off-sheet KEY2
LED1: P1.A-77(77) ; off-sheet LED1
LED2: P1.A-75(75) ; off-sheet LED2
LED3: P1.A-73(73) ; off-sheet LED3
LED4: P1.A-71(71) ; off-sheet LED4
MAC_ALARM: P1.B-35(35) ; off-sheet MAC_ALARM
MAC_BITE: P1.B-37(37) ; off-sheet MAC_BITE
MAC_FREQ_CTRL: P1.B-33(33) ; off-sheet MAC_FREQ_CTRL
MAC_RF_OUT: P1.B-11(11) P1.B-13(13) ; off-sheet MAC_RF_OUT
MAC_RX: P1.B-28(28) ; off-sheet MAC_RX
MAC_TX: P1.B-26(26) ; off-sheet MAC_TX
MAC_USB+: P1.B-72(72) ; off-sheet MAC_USB+
MAC_USB-: P1.B-74(74) ; off-sheet MAC_USB-
MAC_USB_PWR: P1.B-8(8) ; off-sheet MAC_USB_PWR
PCIE_CLK_N: P1.D-38(38) ; off-sheet PCIE_CLK_N
PCIE_CLK_P: P1.D-36(36) ; off-sheet PCIE_CLK_P
PCIE_PERST: P1.C-21(21) ; off-sheet PCIE_PERST
PCIE_RX0_N: P1.D-37(37) ; off-sheet PCIE_RX0_N
PCIE_RX0_P: P1.D-35(35) ; off-sheet PCIE_RX0_P
PCIE_RX1_N: P1.D-32(32) ; off-sheet PCIE_RX1_N
PCIE_RX1_P: P1.D-30(30) ; off-sheet PCIE_RX1_P
PCIE_RX2_N: P1.D-20(20) ; off-sheet PCIE_RX2_N
PCIE_RX2_P: P1.D-18(18) ; off-sheet PCIE_RX2_P
PCIE_RX3_N: P1.D-25(25) ; off-sheet PCIE_RX3_N
PCIE_RX3_P: P1.D-23(23) ; off-sheet PCIE_RX3_P
PCIE_TX0_N: P1.D-31(31) ; off-sheet PCIE_TX0_N
PCIE_TX0_P: P1.D-29(29) ; off-sheet PCIE_TX0_P
PCIE_TX1_N: P1.D-26(26) ; off-sheet PCIE_TX1_N
PCIE_TX1_P: P1.D-24(24) ; off-sheet PCIE_TX1_P
PCIE_TX2_N: P1.D-14(14) ; off-sheet PCIE_TX2_N
PCIE_TX2_P: P1.D-12(12) ; off-sheet PCIE_TX2_P
PCIE_TX3_N: P1.D-19(19) ; off-sheet PCIE_TX3_N
PCIE_TX3_P: P1.D-17(17) ; off-sheet PCIE_TX3_P
SCL: P1.B-67(67) ; off-sheet SCL
SDA: P1.B-61(61) ; off-sheet SDA

Not connected (* = marked no-connect by the designer): P1 A-11(11)* A-12(12)* A-13(13)* A-14(14)* A-15(15)* A-16(16)* A-17(17)* A-18(18)* A-21(21) A-23(23) A-24(24)* A-25(25) A-26(26)* A-27(27) A-28(28)* A-31(31)* A-33(33)* A-35(35) A-36(36)* A-37(37)* A-38(38)* A-41(41)* A-42(42)* A-43(43) A-45(45) A-46(46) A-47(47)* A-48(48) A-51(51)* A-52(52)* A-53(53)* A-54(54) A-55(55)* A-56(56) A-57(57)* A-58(58)* A-61(61)* A-62(62) A-63(63)* A-64(64) A-65(65)* A-66(66)* A-68(68)* A-72(72)* A-74(74)* A-76(76)* A-78(78)* A-79(79)* A-80(80)* A-81(81)* A-82(82)* A-83(83)* A-84(84)* B-1(1)* B-2(2)* B-3(3)* B-4(4)* B-5(5)* B-6(6)* B-7(7)* B-12(12)* B-14(14)* B-15(15)* B-16(16) B-17(17)* B-18(18)* B-22(22)* B-24(24)* B-31(31)* B-32(32)* B-34(34) B-36(36)* B-38(38)* B-41(41)* B-42(42)* B-44(44)* B-45(45)* B-46(46)* B-48(48)* B-51(51)* B-52(52)* B-54(54)* B-55(55)* B-56(56)* B-57(57)* B-58(58)* B-62(62)* B-63(63)* B-64(64) B-65(65)* B-66(66)* B-68(68)* B-71(71) B-73(73)* B-75(75)* B-76(76)* B-77(77) B-78(78)* B-81(81)* B-82(82)* B-83(83)* B-84(84)* C-1(1)* C-2(2)* C-3(3)* C-4(4)* C-5(5)* C-6(6)* C-7(7)* C-8(8)* C-11(11)* C-12(12)* C-13(13)* C-14(14)* C-15(15)* C-16(16)* C-17(17)* C-18(18)* C-22(22)* C-24(24)* C-25(25)* C-26(26)* C-27(27)* C-28(28)* C-31(31) C-32(32)* C-33(33)* C-34(34)* C-35(35)* C-36(36)* C-37(37) C-38(38)* C-41(41)* C-42(42)* C-43(43)* C-44(44)* C-45(45)* C-46(46)* C-47(47)* C-48(48)* C-51(51) C-52(52)* C-53(53)* C-54(54)* C-55(55)* C-56(56)* C-57(57)* C-58(58)* C-61(61)* C-62(62)* C-63(63)* C-64(64)* C-65(65)* C-66(66)* C-67(67)* C-68(68)* C-71(71)* C-72(72)* C-73(73)* C-74(74)* C-75(75)* C-76(76)* C-81(81)* C-82(82)* C-83(83)* C-84(84)* D-1(1)* D-2(2)* D-3(3)* D-4(4)* D-5(5)* D-6(6)* D-7(7)* D-8(8)* D-11(11)* D-13(13)* D-16(16)* D-22(22)* D-28(28)* D-34(34)* D-41(41)* D-42(42)* D-43(43)* D-44(44)* D-45(45)* D-46(46)* D-47(47)* D-48(48)* D-51(51)* D-52(52)* D-53(53)* D-54(54)* D-55(55)* D-56(56)* D-57(57)* D-58(58)* D-61(61)* D-62(62)* D-63(63)* D-64(64)* D-65(65)* D-66(66)* D-67(67)* D-68(68)* D-71(71)* D-72(72)* D-73(73)* D-74(74)* D-75(75)* D-76(76)* D-77(77)* D-78(78)* D-79(79)* D-80(80)* D-81(81)* D-82(82)* D-83(83)* D-84(84)*

### Layout directives
differential pair: PCIE_CLK_N, PCIE_CLK_P, PCIE_RX0_N, PCIE_RX0_P, PCIE_RX1_N, PCIE_RX1_P, PCIE_RX2_N, PCIE_RX2_P, PCIE_RX3_N, PCIE_RX3_P, PCIE_TX0_N, PCIE_TX0_P, PCIE_TX1_N, PCIE_TX1_P, PCIE_TX2_N, PCIE_TX2_P, PCIE_TX3_N, PCIE_TX3_P

### Notes on the sheet
- SHEET
- timingcard.com <http://timingcard.com>
- OF

## Nets that join several sheets
+3.3V: USER_IO (14 pins), POWER (9 pins), MAC (C23.2 C24.1 U3.1 U4.8)
+5.0V: POWER (8 pins), MAC (C62.1 C63.2 U10.P5), FPGA (8 pins)
GND: USER_IO (38 pins), POWER (25 pins), MAC (13 pins), FPGA (56 pins)
ANT1: USER_IO (U6.2), FPGA (P1.B-21)
ANT2: USER_IO (U11.2), FPGA (P1.B-23)
ANT3: USER_IO (U8.4), FPGA (P1.B-25)
ANT4: USER_IO (U12.4), FPGA (P1.B-27)
FPGA_MAC_PPS_IN0-: MAC (R11.2 U3.3), FPGA (P1.B-47)
FPGA_MAC_PPS_IN1-: MAC (R10.2 U3.2), FPGA (P1.B-53)
FPGA_MAC_PPS_OUT-: MAC (R13.2), FPGA (P1.B-43)
LED1: USER_IO (R16.1), FPGA (P1.A-77)
LED2: USER_IO (R28.1), FPGA (P1.A-75)
LED3: USER_IO (R29.1), FPGA (P1.A-73)
LED4: USER_IO (R30.1), FPGA (P1.A-71)
MAC_ALARM: MAC (U10.20), FPGA (P1.B-35)
MAC_BITE: MAC (U10.P6), FPGA (P1.B-37)
MAC_FREQ_CTRL: MAC (U10.P1), FPGA (P1.B-33)
MAC_RF_OUT: MAC (U10.P3), FPGA (P1.B-11 P1.B-13)
MAC_RX: MAC (U10.P7), FPGA (P1.B-28)
MAC_TX: MAC (U10.P8), FPGA (P1.B-26)
MAC_USB+: MAC (U10.2), FPGA (P1.B-72)
MAC_USB-: MAC (U10.4), FPGA (P1.B-74)
MAC_USB_PWR: MAC (U10.6), FPGA (P1.B-8)